# Altium schematic sheet 1_TOP.SchDoc
size A4
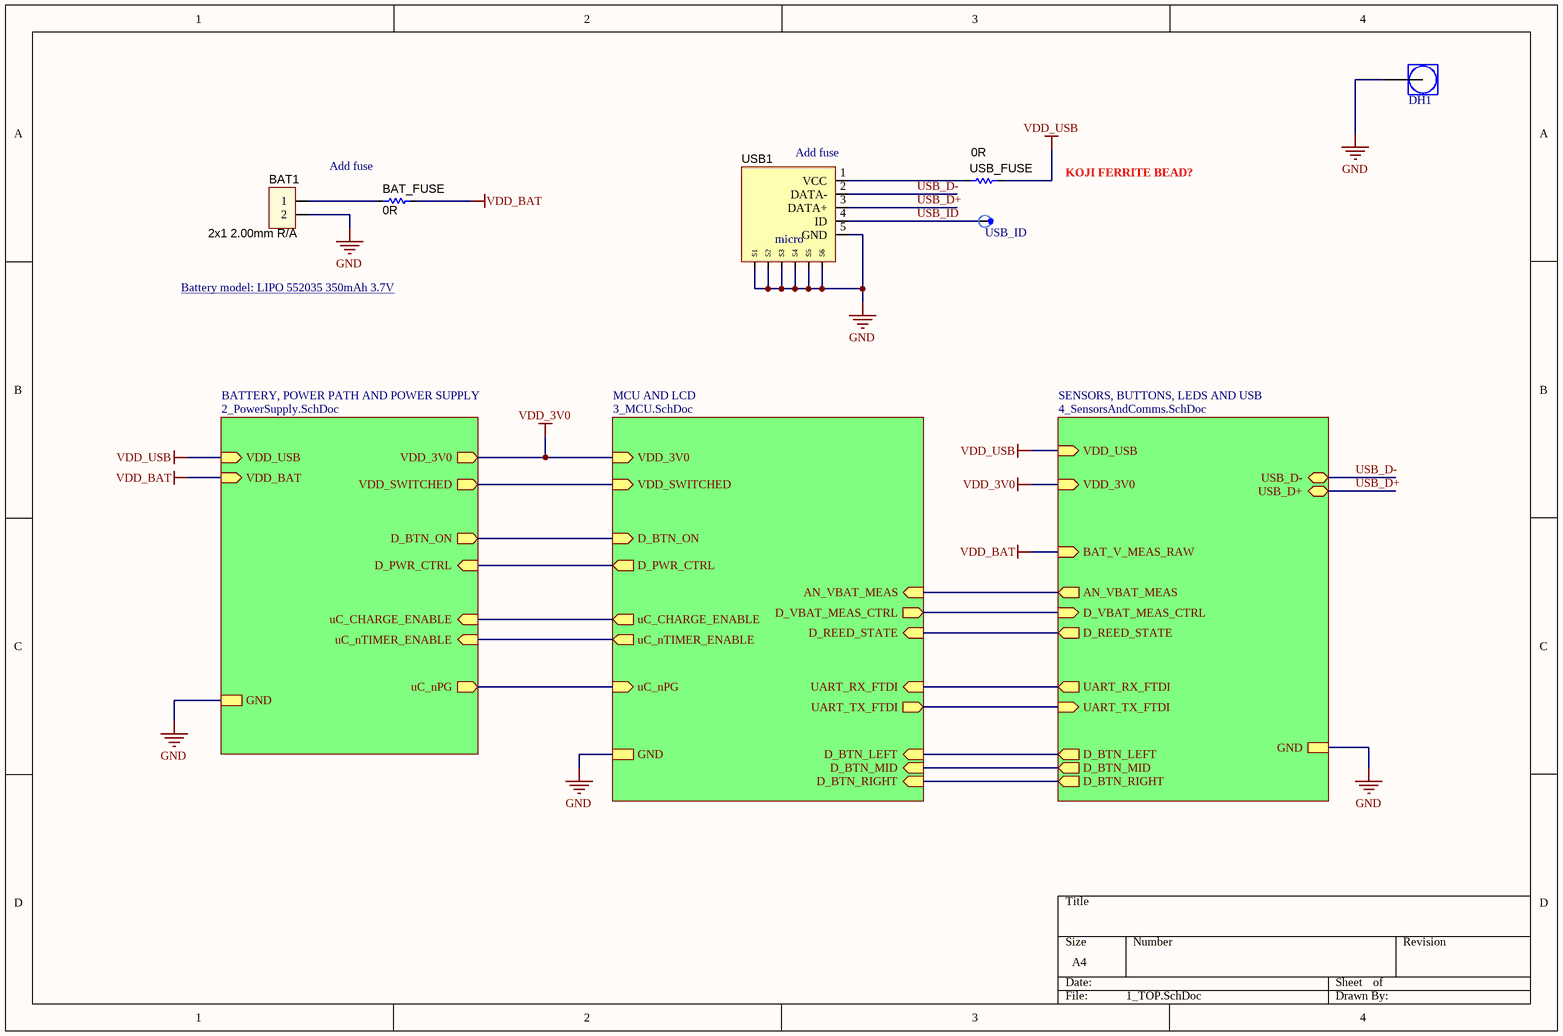
[diagram p0: 1_TOP.SchDoc]

## Parts
BAT1  2x1 2.00mm R/A  [JST R/A MALE 2x2.00MM]
BAT_FUSE  0R  [RES_0603]
DH1  M2_Distancer_Hole_2.2mm  [M2 DISTANCER HOLE]  (value not drawn)
USB1  Micro USB 5-pin  [MicroUSB_5POS]  (value not drawn)
USB_FUSE  0R  [RES_0603]
USB_ID  Testpoint_SMD  [Testpoint_SMD]  (value not drawn)

## Sub-sheets
BATTERY, POWER PATH AND POWER SUPPLY = 2_PowerSupply.SchDoc: VDD_USB (in), VDD_BAT (in), GND, VDD_3V0 (out), uC_nPG (out), uC_nTIMER_ENABLE (in), uC_CHARGE_ENABLE (in), VDD_SWITCHED (out), D_BTN_ON (out), D_PWR_CTRL (in)
MCU AND LCD = 3_MCU.SchDoc: VDD_3V0 (in), D_PWR_CTRL (out), uC_CHARGE_ENABLE (out), uC_nTIMER_ENABLE (out), uC_nPG (in), AN_VBAT_MEAS (in), D_VBAT_MEAS_CTRL (out), GND, D_BTN_ON (in), UART_RX_FTDI (in), UART_TX_FTDI (out), D_REED_STATE (in), D_BTN_LEFT (in), D_BTN_MID (in), D_BTN_RIGHT (in), VDD_SWITCHED (in)
SENSORS, BUTTONS, LEDS AND USB = 4_SensorsAndComms.SchDoc: VDD_3V0 (in), BAT_V_MEAS_RAW (in), AN_VBAT_MEAS (out), D_VBAT_MEAS_CTRL (in), GND, USB_D- (bidir), USB_D+ (bidir), VDD_USB (in), UART_RX_FTDI (out), UART_TX_FTDI (in), D_REED_STATE (out), D_BTN_LEFT (out), D_BTN_MID (out), D_BTN_RIGHT (out)

## Nets
GND: BAT1.2 DH1.1 USB1.5(GND) USB1.S1 USB1.S2 USB1.S3 USB1.S4 USB1.S5 USB1.S6 ; sheet MCU AND LCD/GND, sheet BATTERY, POWER PATH AND POWER SUPPLY/GND, sheet SENSORS, BUTTONS, LEDS AND USB/GND
VDD_3V0: sheet MCU AND LCD/VDD_3V0, sheet BATTERY, POWER PATH AND POWER SUPPLY/VDD_3V0, sheet SENSORS, BUTTONS, LEDS AND USB/VDD_3V0
VDD_BAT: BAT_FUSE.2 ; sheet BATTERY, POWER PATH AND POWER SUPPLY/VDD_BAT, sheet SENSORS, BUTTONS, LEDS AND USB/BAT_V_MEAS_RAW
VDD_USB: USB_FUSE.2 ; sheet BATTERY, POWER PATH AND POWER SUPPLY/VDD_USB, sheet SENSORS, BUTTONS, LEDS AND USB/VDD_USB
USB_D+: USB1.3(DATA+) ; sheet SENSORS, BUTTONS, LEDS AND USB/USB_D+
USB_D-: USB1.2(DATA-) ; sheet SENSORS, BUTTONS, LEDS AND USB/USB_D-
USB_ID: USB1.4(ID) USB_ID.1
NetBAT1_1: BAT1.1 BAT_FUSE.1
NetUSB1_1: USB1.1(VCC) USB_FUSE.1
(unnamed): sheet MCU AND LCD/D_PWR_CTRL, sheet BATTERY, POWER PATH AND POWER SUPPLY/D_PWR_CTRL
(unnamed): sheet MCU AND LCD/uC_CHARGE_ENABLE, sheet BATTERY, POWER PATH AND POWER SUPPLY/uC_CHARGE_ENABLE
(unnamed): sheet MCU AND LCD/uC_nTIMER_ENABLE, sheet BATTERY, POWER PATH AND POWER SUPPLY/uC_nTIMER_ENABLE
(unnamed): sheet MCU AND LCD/uC_nPG, sheet BATTERY, POWER PATH AND POWER SUPPLY/uC_nPG
(unnamed): sheet MCU AND LCD/AN_VBAT_MEAS, sheet SENSORS, BUTTONS, LEDS AND USB/AN_VBAT_MEAS
(unnamed): sheet MCU AND LCD/D_VBAT_MEAS_CTRL, sheet SENSORS, BUTTONS, LEDS AND USB/D_VBAT_MEAS_CTRL
(unnamed): sheet MCU AND LCD/D_BTN_ON, sheet BATTERY, POWER PATH AND POWER SUPPLY/D_BTN_ON
(unnamed): sheet MCU AND LCD/UART_RX_FTDI, sheet SENSORS, BUTTONS, LEDS AND USB/UART_RX_FTDI
(unnamed): sheet MCU AND LCD/UART_TX_FTDI, sheet SENSORS, BUTTONS, LEDS AND USB/UART_TX_FTDI
(unnamed): sheet MCU AND LCD/D_REED_STATE, sheet SENSORS, BUTTONS, LEDS AND USB/D_REED_STATE
(unnamed): sheet MCU AND LCD/D_BTN_LEFT, sheet SENSORS, BUTTONS, LEDS AND USB/D_BTN_LEFT
(unnamed): sheet MCU AND LCD/D_BTN_MID, sheet SENSORS, BUTTONS, LEDS AND USB/D_BTN_MID
(unnamed): sheet MCU AND LCD/D_BTN_RIGHT, sheet SENSORS, BUTTONS, LEDS AND USB/D_BTN_RIGHT
(unnamed): sheet MCU AND LCD/VDD_SWITCHED, sheet BATTERY, POWER PATH AND POWER SUPPLY/VDD_SWITCHED

## Notes on the sheet
- Add fuse
- (near USB1) Add fuse
- KOJI FERRITE BEAD?
- Battery model: LIPO 552035 350mAh 3.7V <https://www.svebaterije.net/media/ckfinder_files/files/data-sheet-LiPo552035-TriaxPower.pdf>
- (in symbol CONN_USB-TYPEB_MICRO) micro

## Library data of the parts
BAT1 = CONN_JST_TH_R/A_2x1M_2.0mm: Connector JST-PH through-hole right angle 2.0mm pitch; Manufacturer: JST Sales America Inc.; Manufacturer Part Number: S2B-PH-K-S; Mating Part Number: PHR-2; Supplier: Kelco; Supplier Part Number: 16232; Value: 2x1 2.00mm R/A
BAT_FUSE USB_FUSE = RES_0R_1%_0.1W_0603: Resistor SMD 0603 0R 0.1W 1%; Manufacturer: n/a; Manufacturer Part Number: n/a; Supplier: Kelco; Supplier Part Number: 13738; Resistance: 0R; Package: 0603; Power Rating: 0.1W; Tolerance: 1%
DH1 = M2_Distancer_Hole_2.2mm: M2 Distancer hole
USB1 = CONN_USB-TYPEB_MICRO: Micro USB 5-pin connector; Manufacturer: MOLEX; Manufacturer Part Number: 1050170001; Supplier: Kelco; Supplier Part Number: 18174; Value: Micro USB 5-pin; Package: R/A microUSB; Operating Temperature: *